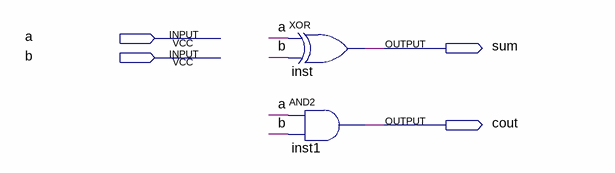
[diagram p0: schematic sheet]
// Quartus schematic pfs_half_adder.bdf as structural Verilog: 2 symbols, 4 pins
module pfs_half_adder (
  input  a,
  input  b,
  output sum,
  output cout
);

  xor inst (sum, a, b);
  and inst1 (cout, a, b);
endmodule
